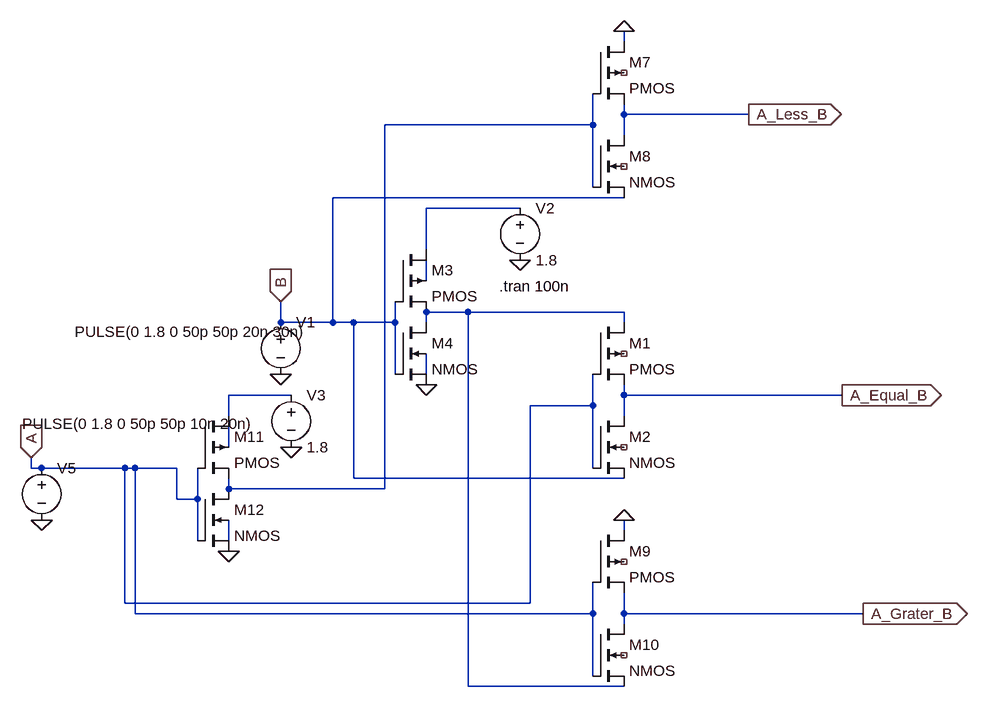
[diagram p0: schematic Comparator.asc]
Comparator.asc, the LTspice schematic file:
Version 4.1
SHEET 1 880 728
WIRE 304 -272 304 -288
WIRE 304 -160 304 -176
WIRE 496 -160 304 -160
WIRE 256 -144 256 -192
WIRE 256 -144 -64 -144
WIRE 304 -128 304 -160
WIRE 256 -48 256 -144
WIRE 304 -32 -144 -32
WIRE 144 -16 0 -16
WIRE 0 48 0 -16
WIRE 0 96 0 64
WIRE 64 144 0 144
WIRE 304 144 64 144
WIRE -224 160 -224 128
WIRE -144 160 -144 -32
WIRE -144 160 -224 160
WIRE -112 160 -144 160
WIRE -48 160 -48 128
WIRE -48 160 -112 160
WIRE 0 160 0 144
WIRE 304 160 304 144
WIRE -48 240 -48 160
WIRE 0 240 0 208
WIRE -208 272 -304 272
WIRE 304 272 304 256
WIRE 640 272 304 272
WIRE 256 288 256 240
WIRE 256 288 160 288
WIRE -304 304 -304 272
WIRE 304 304 304 272
WIRE -304 352 -304 320
WIRE -608 384 -608 368
WIRE -592 384 -608 384
WIRE -464 384 -592 384
WIRE -448 384 -464 384
WIRE -384 384 -448 384
WIRE 256 384 256 288
WIRE -112 400 -112 160
WIRE 304 400 -112 400
WIRE -304 416 -304 400
WIRE -64 416 -64 -144
WIRE -64 416 -304 416
WIRE -384 432 -384 384
WIRE -352 432 -352 384
WIRE -352 432 -384 432
WIRE 304 480 304 464
WIRE -352 496 -352 432
WIRE -304 496 -304 464
WIRE -464 592 -464 384
WIRE 160 592 160 288
WIRE 160 592 -464 592
WIRE -448 608 -448 384
WIRE 256 608 256 560
WIRE 256 608 -448 608
WIRE 304 608 304 576
WIRE 672 608 304 608
WIRE 304 624 304 608
WIRE 256 704 256 608
WIRE 64 720 64 144
WIRE 304 720 64 720
FLAG -224 240 0
FLAG -224 128 B
IOPIN -224 128 In
FLAG 144 64 0
FLAG 0 256 0
FLAG 640 272 A_Equal_B
IOPIN 640 272 Out
FLAG 304 -288 0
FLAG 304 464 0
FLAG -304 512 0
FLAG -592 464 0
FLAG -608 368 A
IOPIN -608 368 In
FLAG -208 352 0
FLAG 496 -160 A_Less_B
IOPIN 496 -160 Out
FLAG 672 608 A_Grater_B
IOPIN 672 608 Out
SYMBOL pmos4 256 160 R0
SYMATTR InstName M1
SYMBOL nmos4 256 304 R0
SYMATTR InstName M2
SYMBOL pmos4 -48 48 R0
SYMATTR InstName M3
SYMBOL nmos4 -48 160 R0
SYMATTR InstName M4
SYMBOL voltage -224 144 R0
WINDOW 3 -317 30 Left 2
WINDOW 123 0 0 Left 0
WINDOW 39 0 0 Left 0
SYMATTR Value PULSE(0 1.8 0 50p 50p 20n 30n)
SYMATTR InstName V1
SYMBOL voltage 144 -32 R0
WINDOW 123 0 0 Left 0
WINDOW 39 0 0 Left 0
SYMATTR InstName V2
SYMATTR Value 1.8
SYMBOL pmos4 256 -272 R0
SYMATTR InstName M7
SYMBOL nmos4 256 -128 R0
SYMATTR InstName M8
SYMBOL pmos4 256 480 R0
SYMATTR InstName M9
SYMBOL nmos4 256 624 R0
SYMATTR InstName M10
SYMBOL pmos4 -352 304 R0
SYMATTR InstName M11
SYMBOL nmos4 -352 416 R0
SYMATTR InstName M12
SYMBOL voltage -592 368 R0
WINDOW 3 -30 -52 Left 2
WINDOW 123 0 0 Left 0
WINDOW 39 0 0 Left 0
SYMATTR Value PULSE(0 1.8 0 50p 50p 10n 20n)
SYMATTR InstName V5
SYMBOL voltage -208 256 R0
WINDOW 123 0 0 Left 0
WINDOW 39 0 0 Left 0
SYMATTR InstName V3
SYMATTR Value 1.8
TEXT 112 104 Left 2 !.tran 100n

The netlist it stands for:
* Comparator.asc
M1 N004 A A_Equal_B NC_01 PMOS
M2 A_Equal_B A B NC_02 NMOS
M3 N002 B N004 N003 PMOS
M4 N004 B 0 N005 NMOS
V1 B 0 PULSE(0 1.8 0 50p 50p 20n 30n)
V2 N002 0 1.8
M7 0 N001 A_Less_B NC_03 PMOS
M8 A_Less_B N001 B NC_04 NMOS
M9 0 A A_Grater_B NC_05 PMOS
M10 A_Grater_B A N004 NC_06 NMOS
M11 N006 A N001 N007 PMOS
M12 N001 A 0 N008 NMOS
V5 A 0 PULSE(0 1.8 0 50p 50p 10n 20n)
V3 N006 0 1.8
.model NMOS NMOS
.model PMOS PMOS
.lib standard.mos
.tran 100n
.backanno
.end